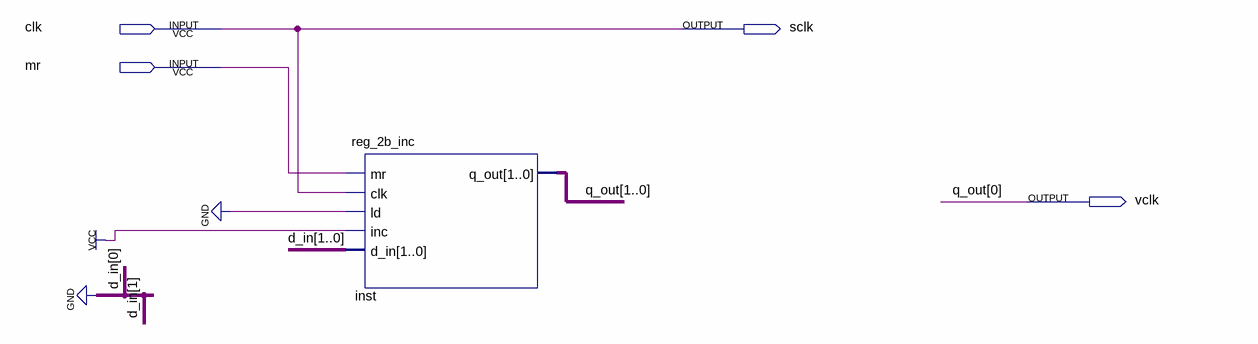
[diagram p0: schematic sheet]
// Quartus schematic PLL.bdf as structural Verilog: 1 symbols, 4 pins
module PLL (
  input  clk,
  input  mr,
  output sclk,
  output vclk
);

  wire [1:1] q_out;

  reg_2b_inc inst (.mr(mr), .clk(clk), .ld(1'b0), .inc(1'b1), .d_in(2'b00), .q_out({q_out[1], vclk}));

  assign sclk = clk;

  // Other names for the same wires on the sheet: q_out[0] = vclk
endmodule
